# Altium project Remie_Morse.PrjPcb (part 3 of 3)
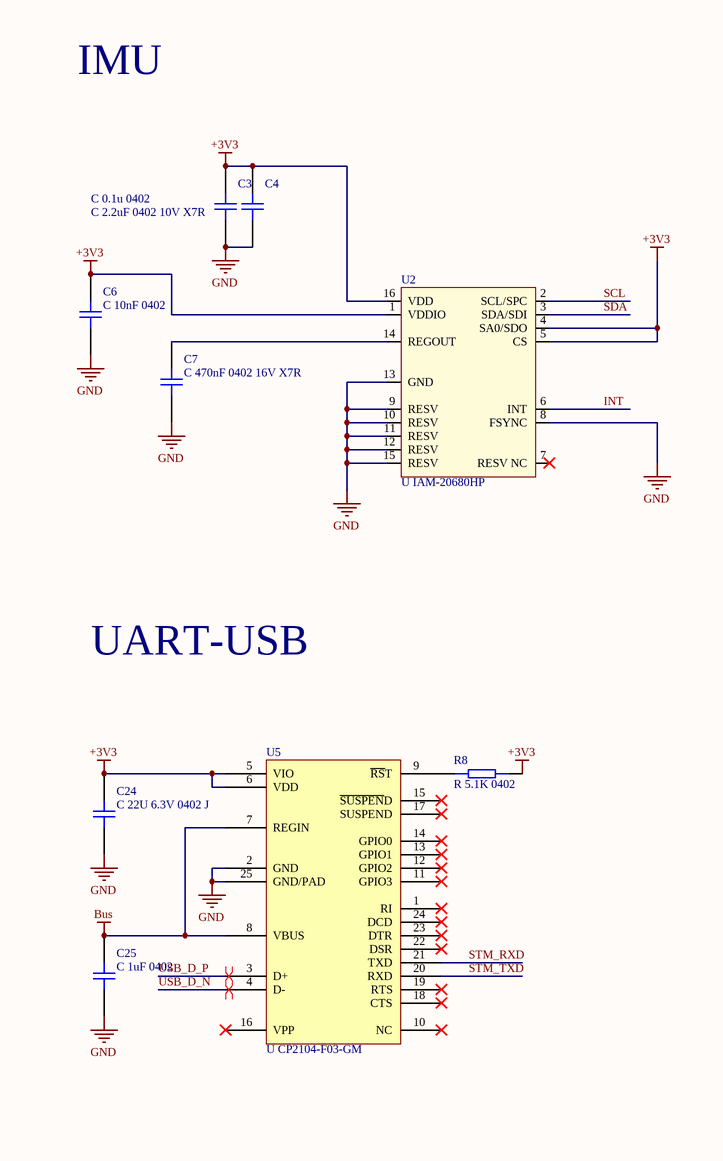
[diagram p3: Remie_Schematic.SchDoc, right]

## Sheet Remie_Schematic.SchDoc (continued)

### Library data of the parts (continued)
U3 = U STM32WB55CEU6: Bluetooth v5.0 and 802.15.4 With Microcontroller Combo module; Manufacturer: STMicroelectronics; Supplier: Digi-Key; Supplier Part Number: 497-18490-ND; Manufacturer Part Number: STM32WB55CEU6; RoHS: Yes; Category: RF Receivers, Transceivers; Stock: 13770; Pricing: 1=6,57, 10=5,935, 25=5,6588, 80=4,91363, 260=4,69273, 520=4,27867, 1040=3,72659, 2600=3,58856 (USD); ComponentLink1URL: https://datasheet.octopart.com/STM32WB55CEU6-STMicroelectronics-datasheet-133510350.pdf?src-supplier=Future+Electronics; ComponentLink1Description: https://datasheet.octopart.com/STM32WB55CEU6-STMicroelectronics-datasheet-133510350.pdf?src-supplier=Future+Electronics; ComponentLink2URL: https://www.st.com/resource/en/datasheet/stm32wb55rg.pdf?src-supplier=Digi-Key; ComponentLink2Description: https://www.st.com/resource/en/datasheet/stm32wb55rg.pdf?src-supplier=Digi-Key
U4 = U LTC4412HVIS6#TRMPBF: IC OR CTRLR SRC SELECT TSOT23-6 Power Management Specialised - PMIC 36V, Low Loss PowerPath Controller in ThinSOT; Manufacturer: Analog Devices / Linear Technology; Number of Outputs: 1; Turn-On Delay Time: 110us; Turn-Off Delay Time: 13us; Operating Supply Current: 19uA; Supplier: Mouser; Supplier Part Number: 584-C4412HVIS6TRMPBF; Manufacturer Part Number: LTC4412HVIS6#TRMPBF; RoHS: Yes; Category: Power Management ICs; Stock: 16791; Pricing: 1=6,18, 10=4,43, 50=4,43, 100=3,75, 1000=2,96, 10000=2,88 (USD); Case/Package: TSOT; Pins: 6; Min Operating Temperature: -40°C; Max Operating Temperature: 125°C; Package Quantity: 1; Packaging: Tape and Reel; Series: PowerPath™; Length: 2.9mm; Radiation Hardening: No; RoHS Compliant: Yes; ComponentLink1URL: https://datasheet.ciiva.com/15104/getdatasheetpartid-365863-15104231.pdf?src-supplier=Verical; ComponentLink1Description: https://datasheet.ciiva.com/15104/getdatasheetpartid-365863-15104231.pdf?src-supplier=Verical; ComponentLink2URL: https://datasheet.ciiva.com/6609/1911-6609596.pdf?src-supplier=Digikey; ComponentLink2Description: https://datasheet.ciiva.com/6609/1911-6609596.pdf?src-supplier=Digikey; ComponentLink3URL: https://datasheet.ciiva.com/6609/1911-6609595.pdf?src-supplier=Digikey; ComponentLink3Description: https://datasheet.ciiva.com/6609/1911-6609595.pdf?src-supplier=Digikey; ComponentLink4URL: https://datasheet.ciiva.com/29364/679934-da-01-en-spreg-ltc4412hvis6-trmpbf-tsot-23-6-ltc-29364492.pdf?src-supplier=Conrad; ComponentLink4Description: https://datasheet.ciiva.com/29364/679934-da-01-en-spreg-ltc4412hvis6-trmpbf-tsot-23-6-ltc-29364492.pdf?src-supplier=Conrad
U5 = U CP2104-F03-GM: IC SGL USB-TO-UART BRIDGE 24QFN; Manufacturer: Silicon Labs; Data Rate: 2Mbps; Operating Supply Current: 17mA; Number of Channels: 1; Operating Supply Voltage: 3.3V; Max Supply Voltage: 3.6V; Min Supply Voltage: 3V; Supplier 1: RSComponents; Manufacturer Part Number: CP2104-F03-GM; RoHS: Yes; Category: Interface ICs; Case/Package: QFN; Number of Pins: 24; Weight: 0.001764oz; Contact Plating: Tin,Matte; Min Operating Temperature: -40°C; Max Operating Temperature: 85°C; Packaging: Rail/Tube; Series: -; Number of Transceivers: 1; Radiation Hardening: No; RoHS Compliant: Yes; ComponentLink1URL: https://datasheet.ciiva.com/4783/cp2104-37496-4783142.pdf?src-supplier=Mouser; ComponentLink1Description: https://datasheet.ciiva.com/4783/cp2104-37496-4783142.pdf?src-supplier=Mouser; ComponentLink2URL: https://datasheet.ciiva.com/25624/0900766b811077c2-25624104.pdf?src-supplier=RSComponents; ComponentLink2Description: https://datasheet.ciiva.com/25624/0900766b811077c2-25624104.pdf?src-supplier=RSComponents; ComponentLink3URL: https://datasheet.ciiva.com/16639/cp2104-16639755.pdf?src-supplier=Avnet+Europe; ComponentLink3Description: https://datasheet.ciiva.com/16639/cp2104-16639755.pdf?src-supplier=Avnet+Europe; ComponentLink4URL: https://datasheet.ciiva.com/26919/getdatasheetpartid-556411-26919822.pdf?src-supplier=Verical; ComponentLink4Description: https://datasheet.ciiva.com/26919/getdatasheetpartid-556411-26919822.pdf?src-supplier=Verical; ComponentLink5URL: https://datasheet.ciiva.com/26840/cp2104-f03-gm-26840141.pdf?src-supplier=IIIC; ComponentLink5Description: https://datasheet.ciiva.com/26840/cp2104-f03-gm-26840141.pdf?src-supplier=IIIC; ComponentLink6URL: https://datasheet.ciiva.com/8128/cp2104-8128046.pdf?src-supplier=Avnet; ComponentLink6Description: https://datasheet.ciiva.com/8128/cp2104-8128046.pdf?src-supplier=Avnet; Supplier Part Number 1: 1689917
XTAL1 = XTAL ABM11W-32.0000MHZ-7-D1X-T3: Crystal 32MHz 7pF 4-Pin CSMD T/R; Manufacturer: Abracon; Supplier: Future Electronics; Supplier Part Number: 4135798; Manufacturer Part Number: ABM11W-32.0000MHZ-7-D1X-T3; RoHS: Yes; Category: Crystals; Stock: 129000; Pricing: 3000=0,42, 6000=0,415, 9000=0,41, 12000=0,405, 15000=0,395 (USD); ComponentLink1URL: https://abracon.com/Resonators/ABM11W.pdf?src-supplier=Digi-Key; ComponentLink1Description: https://abracon.com/Resonators/ABM11W.pdf?src-supplier=Digi-Key; ComponentLink2URL: https://datasheet.octopart.com/ABM11W-32.0000MHZ-7-D1X-T3-Abracon-datasheet-112015802.pdf?src-supplier=Master+Electronics; ComponentLink2Description: https://datasheet.octopart.com/ABM11W-32.0000MHZ-7-D1X-T3-Abracon-datasheet-112015802.pdf?src-supplier=Master+Electronics